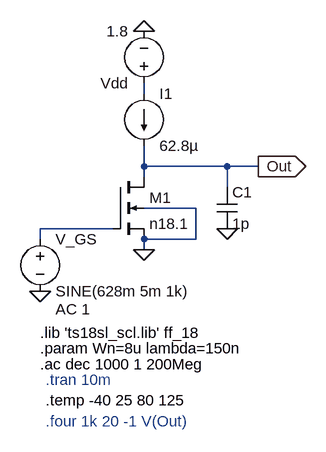
[diagram p0: schematic q3.asc]
q3.asc, the LTspice schematic file:
Version 4.1
SHEET 1 1032 680
WIRE 304 0 304 -16
WIRE 304 112 304 80
WIRE 432 112 304 112
WIRE 480 112 432 112
WIRE 304 128 304 112
WIRE 432 144 432 112
WIRE 384 176 304 176
WIRE 256 208 144 208
WIRE 144 224 144 208
WIRE 384 224 384 176
WIRE 384 224 304 224
WIRE 304 240 304 224
FLAG 304 -96 0
FLAG 304 240 0
FLAG 144 304 0
FLAG 480 112 Out
IOPIN 480 112 Out
FLAG 432 208 0
SYMBOL voltage 304 0 R180
WINDOW 123 0 0 Left 0
WINDOW 39 0 0 Left 0
SYMATTR InstName Vdd
SYMATTR Value 1.8
SYMBOL nmos4 256 128 R0
SYMATTR InstName M1
SYMATTR Value n18.1
SYMATTR Value2 l={2*lambda} w={Wn} ad={5*lambda*Wn} as={5*lambda*Wn} pd={2*Wn + 10*lambda} ps={2*Wn + 10*lambda}
SYMBOL voltage 144 208 R0
WINDOW 123 24 124 Left 2
WINDOW 39 0 0 Left 0
SYMATTR Value2 AC 1
SYMATTR InstName V_GS
SYMATTR Value SINE(628m 5m 1k)
SYMBOL current 304 0 R0
WINDOW 123 0 0 Left 0
WINDOW 39 0 0 Left 0
SYMATTR InstName I1
SYMATTR Value 62.8µ
SYMBOL cap 416 144 R0
SYMATTR InstName C1
SYMATTR Value 1p
TEXT 144 392 Left 2 !.param Wn=8u lambda=150n
TEXT 144 368 Left 2 !.lib 'ts18sl_scl.lib' ff_18
TEXT 144 416 Left 2 !.ac dec 1000 1 200Meg
TEXT 152 440 Left 2 ;.tran 10m
TEXT 152 472 Left 2 !.temp -40 25 80 125
TEXT 152 504 Left 2 ;.four 1k 20 -1 V(Out)

The netlist it stands for:
* q3.asc
Vdd N001 0 1.8
M1 Out N002 0 0 n18.1 l={2*lambda} w={Wn} ad={5*lambda*Wn} as={5*lambda*Wn} pd={2*Wn + 10*lambda} ps={2*Wn + 10*lambda}
V_GS N002 0 SINE(628m 5m 1k) AC 1
I1 N001 Out 62.8µ
C1 Out 0 1p
.model NMOS NMOS
.model PMOS PMOS
.lib standard.mos
.param Wn=8u lambda=150n
.lib 'ts18sl_scl.lib' ff_18
.ac dec 1000 1 200Meg
* .tran 10m
.temp -40 25 80 125
* .four 1k 20 -1 V(Out)
.backanno
.end